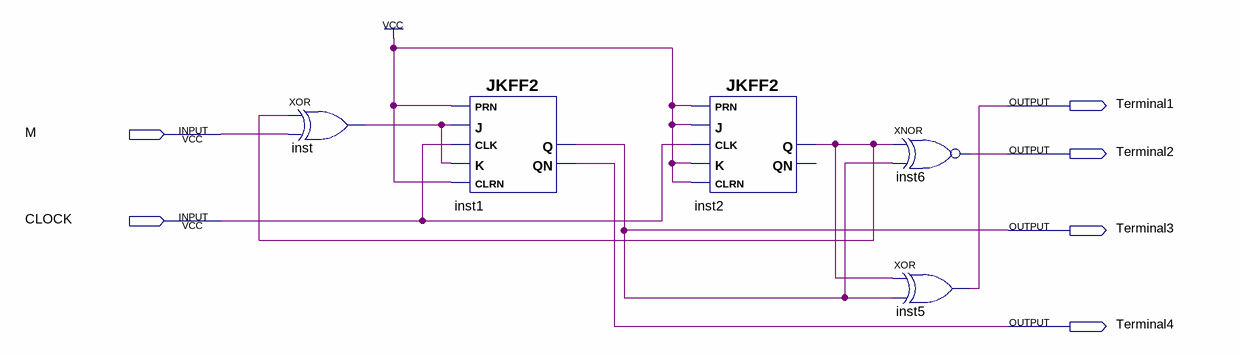
[diagram p0: schematic sheet]
// Quartus schematic lista5.bdf as structural Verilog: 5 symbols, 6 pins
module lista5 (
  input  M,
  input  CLOCK,
  output Terminal1,
  output Terminal2,
  output Terminal3,
  output Terminal4
);

  wire inst2_q, inst_out;

  xor inst (inst_out, inst2_q, M);
  JKFF2 inst1 (.K(inst_out), .CLRN(1'b1), .CLK(CLOCK), .PRN(1'b1), .J(inst_out), .QN(Terminal4), .Q(Terminal3));
  JKFF2 inst2 (.K(1'b1), .CLRN(1'b1), .CLK(CLOCK), .PRN(1'b1), .J(1'b1), .Q(inst2_q));  // open: QN
  xnor inst6 (Terminal2, inst2_q, Terminal3);
  xor inst5 (Terminal1, inst2_q, Terminal3);
endmodule
